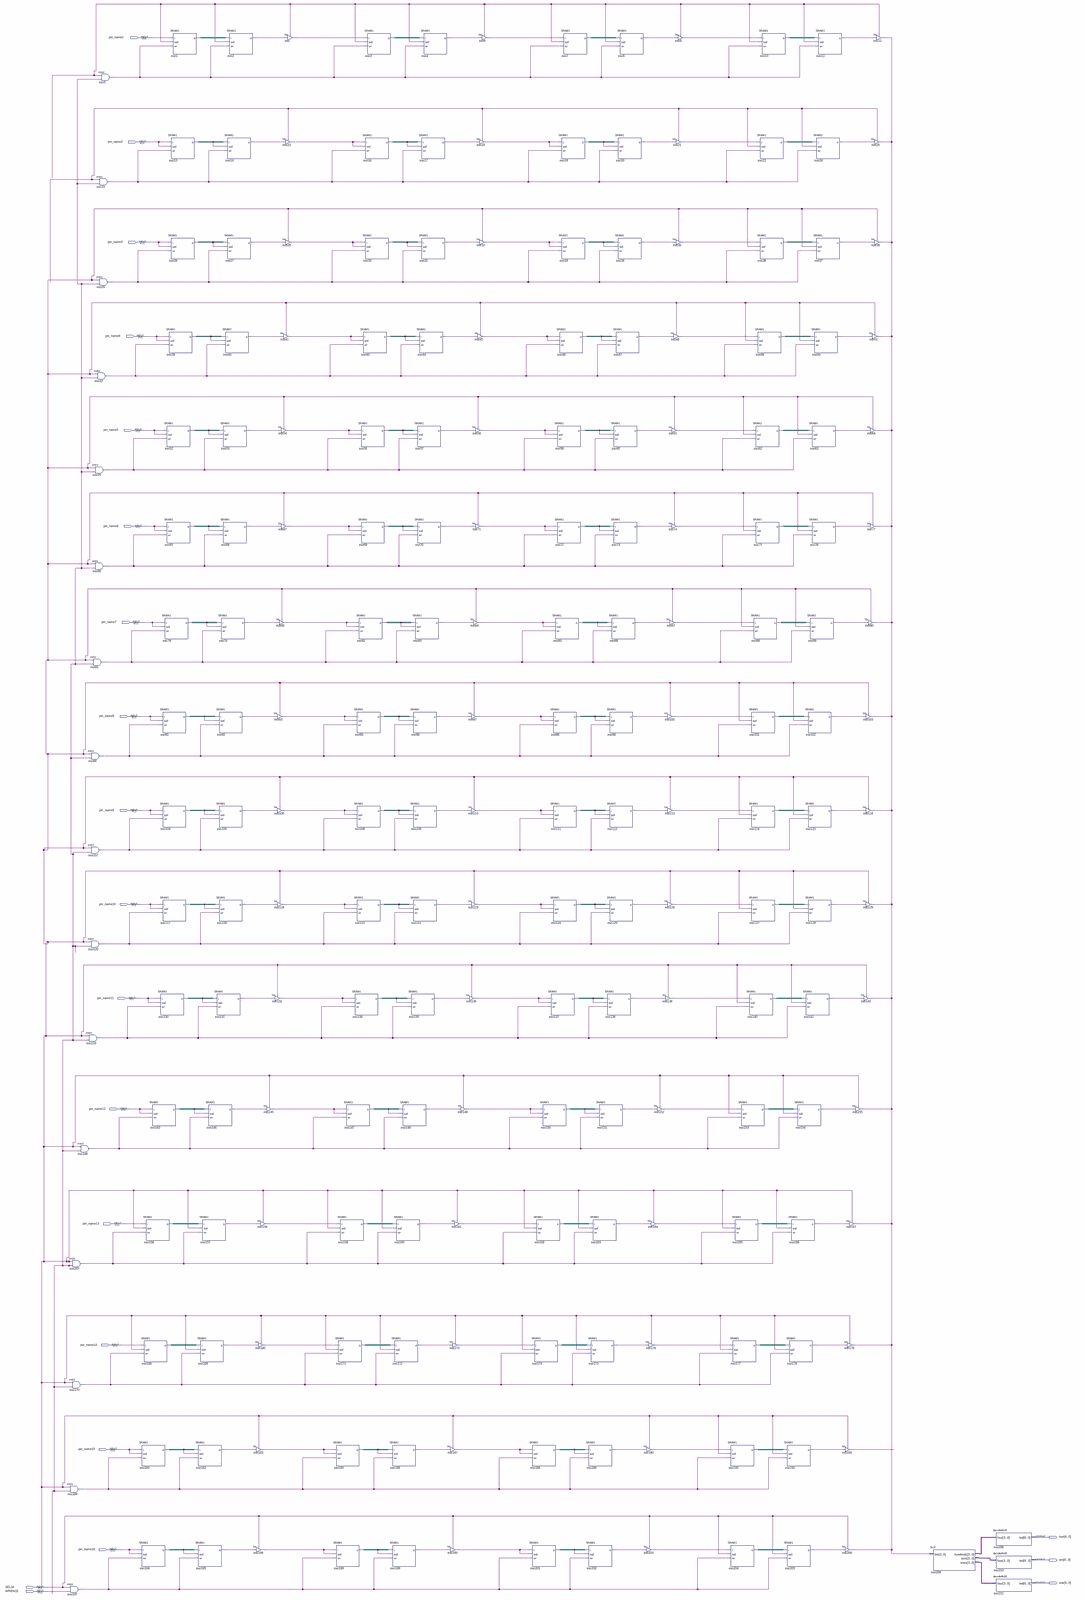
[diagram p0: schematic sheet, whole]
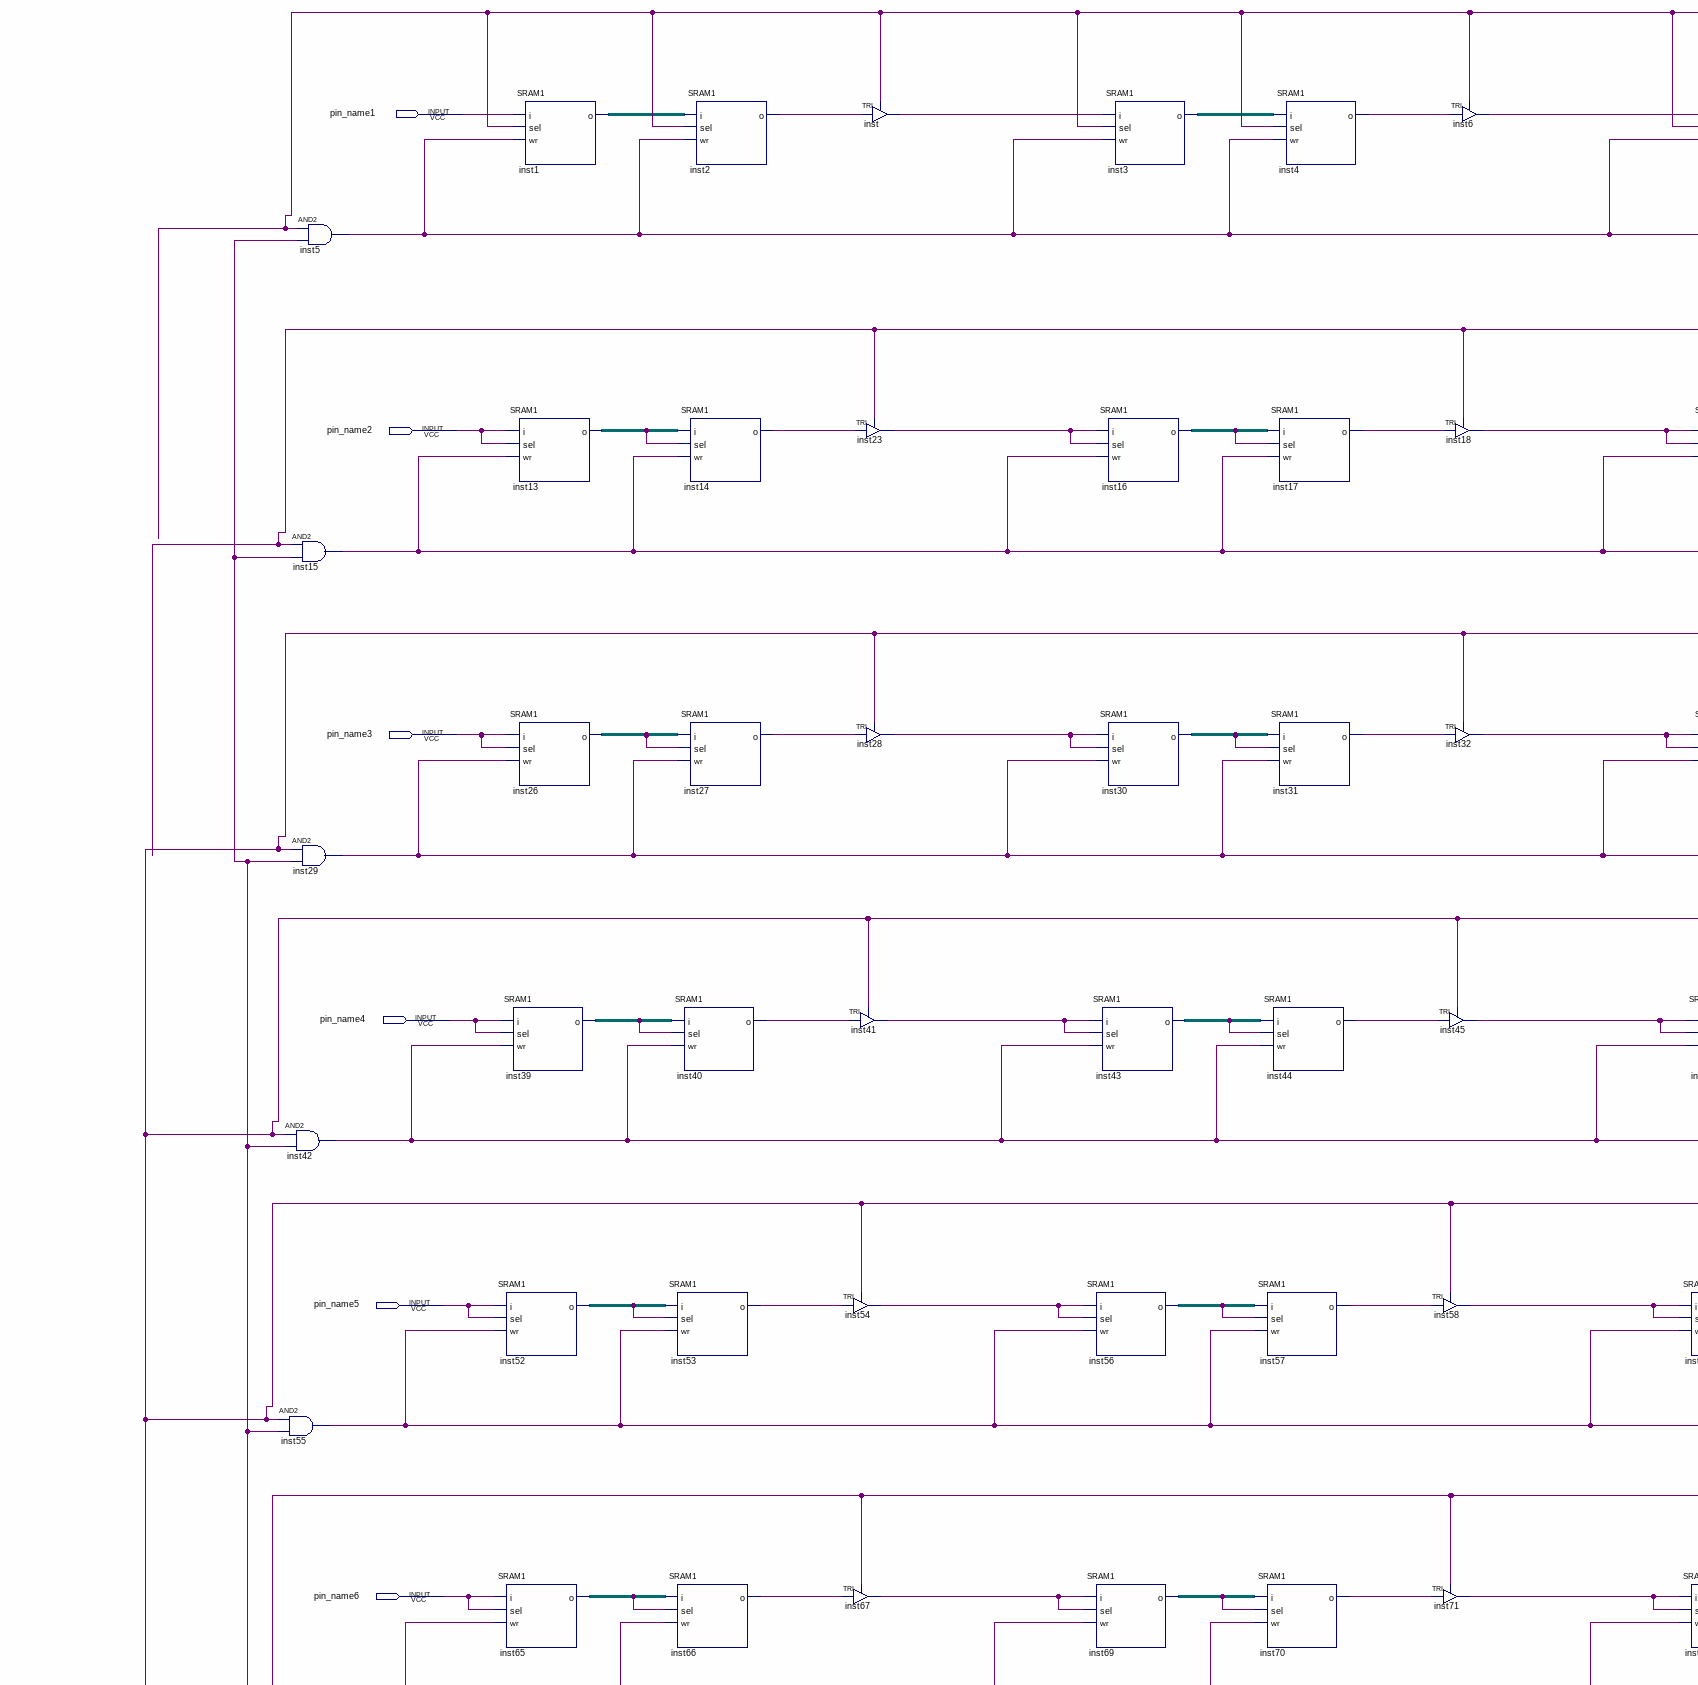
[diagram p1: schematic sheet, upper left part]
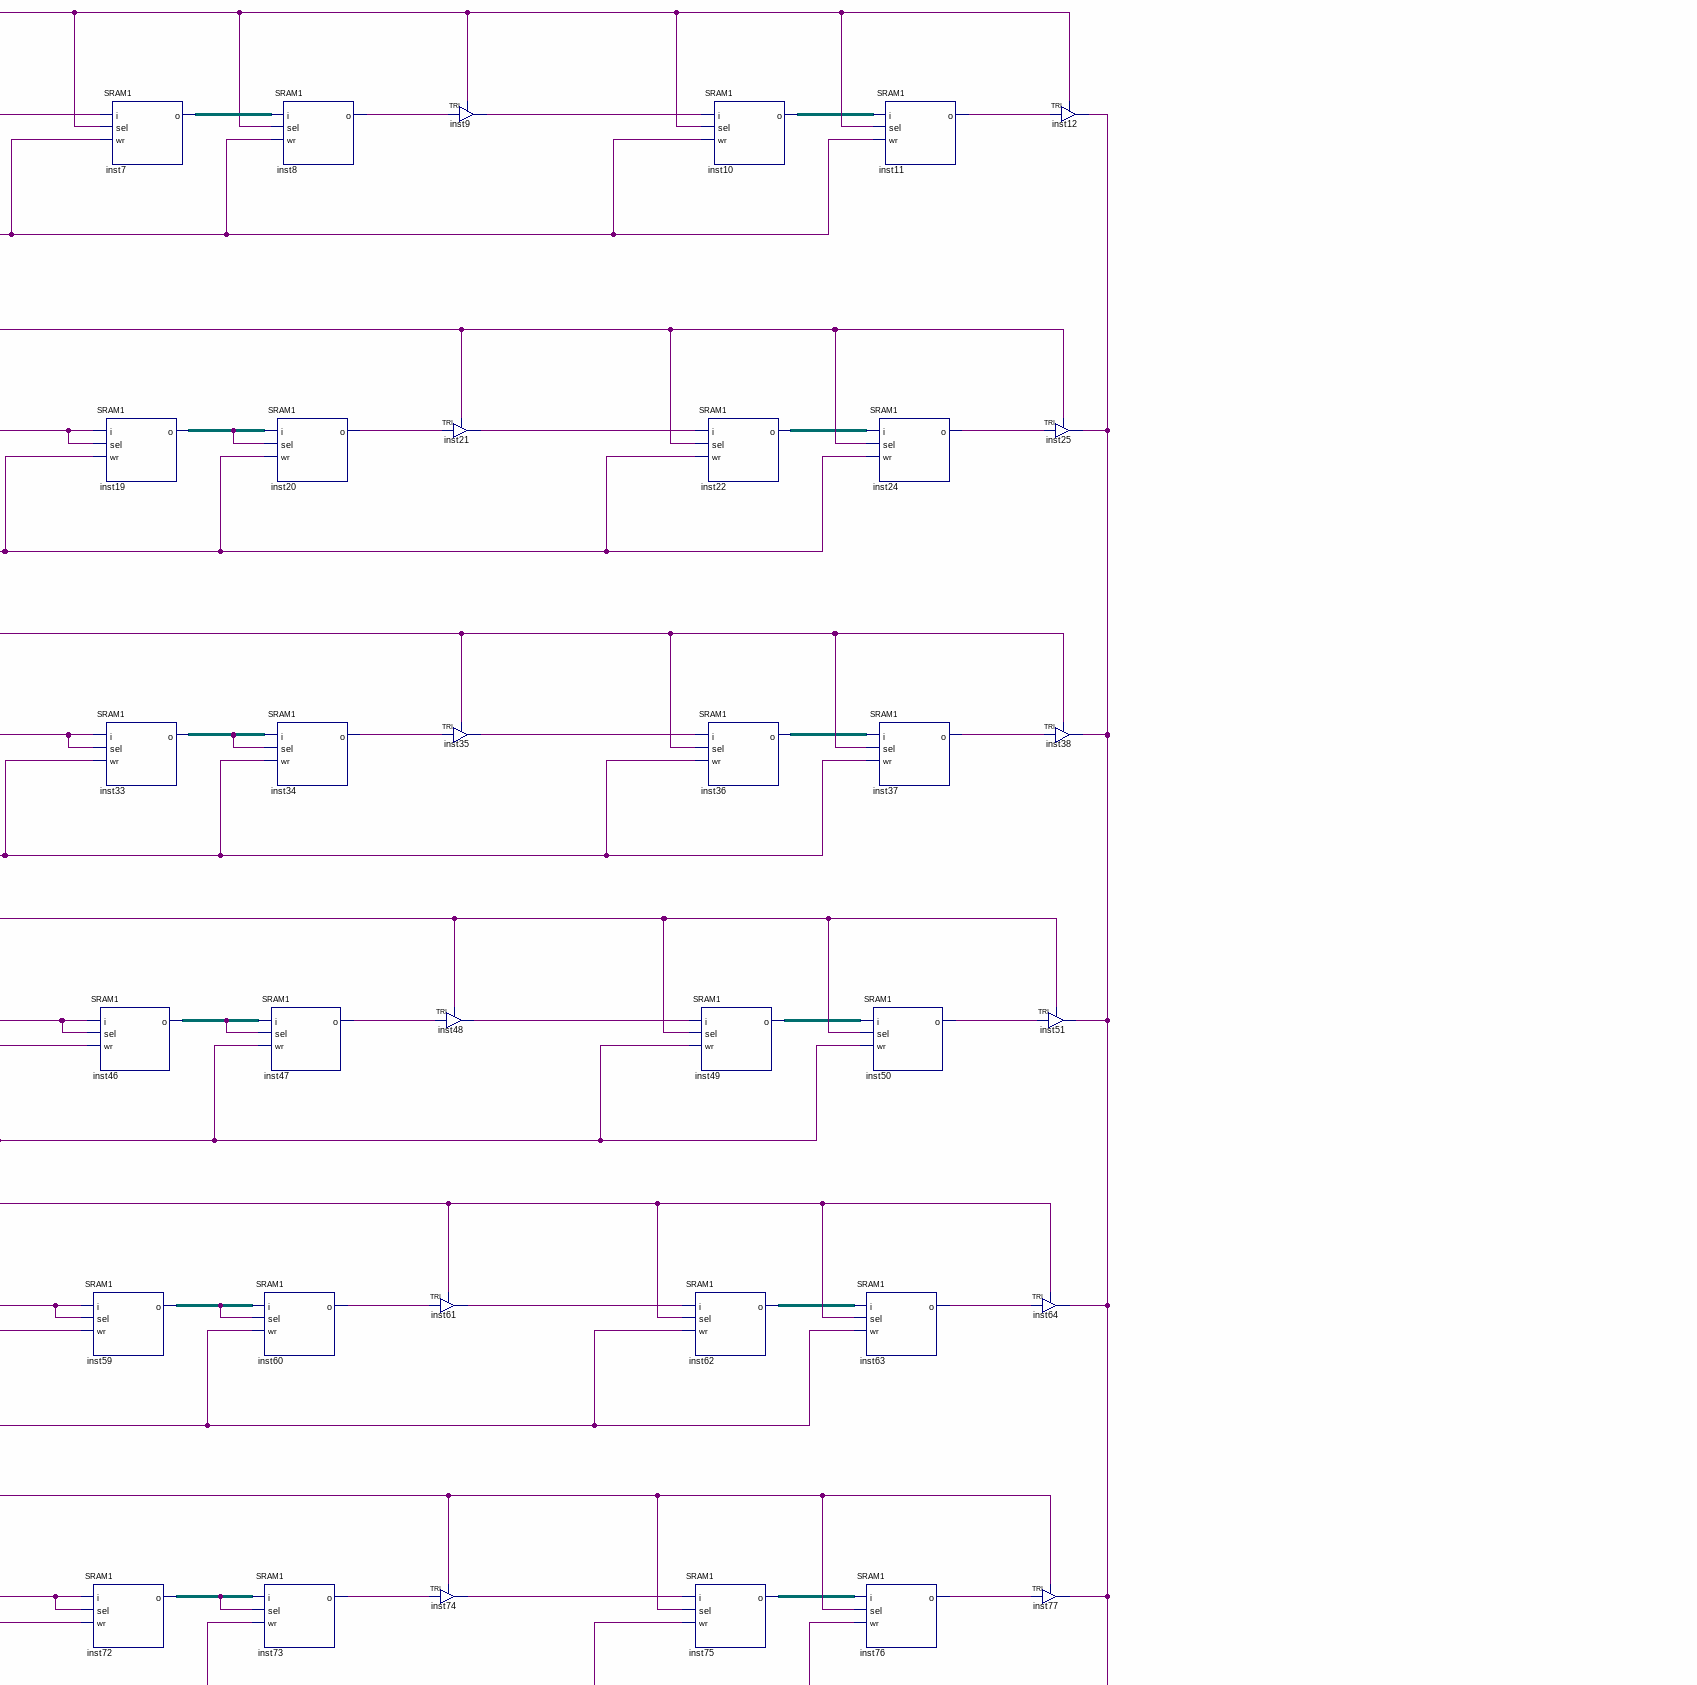
[diagram p2: schematic sheet, upper right part]
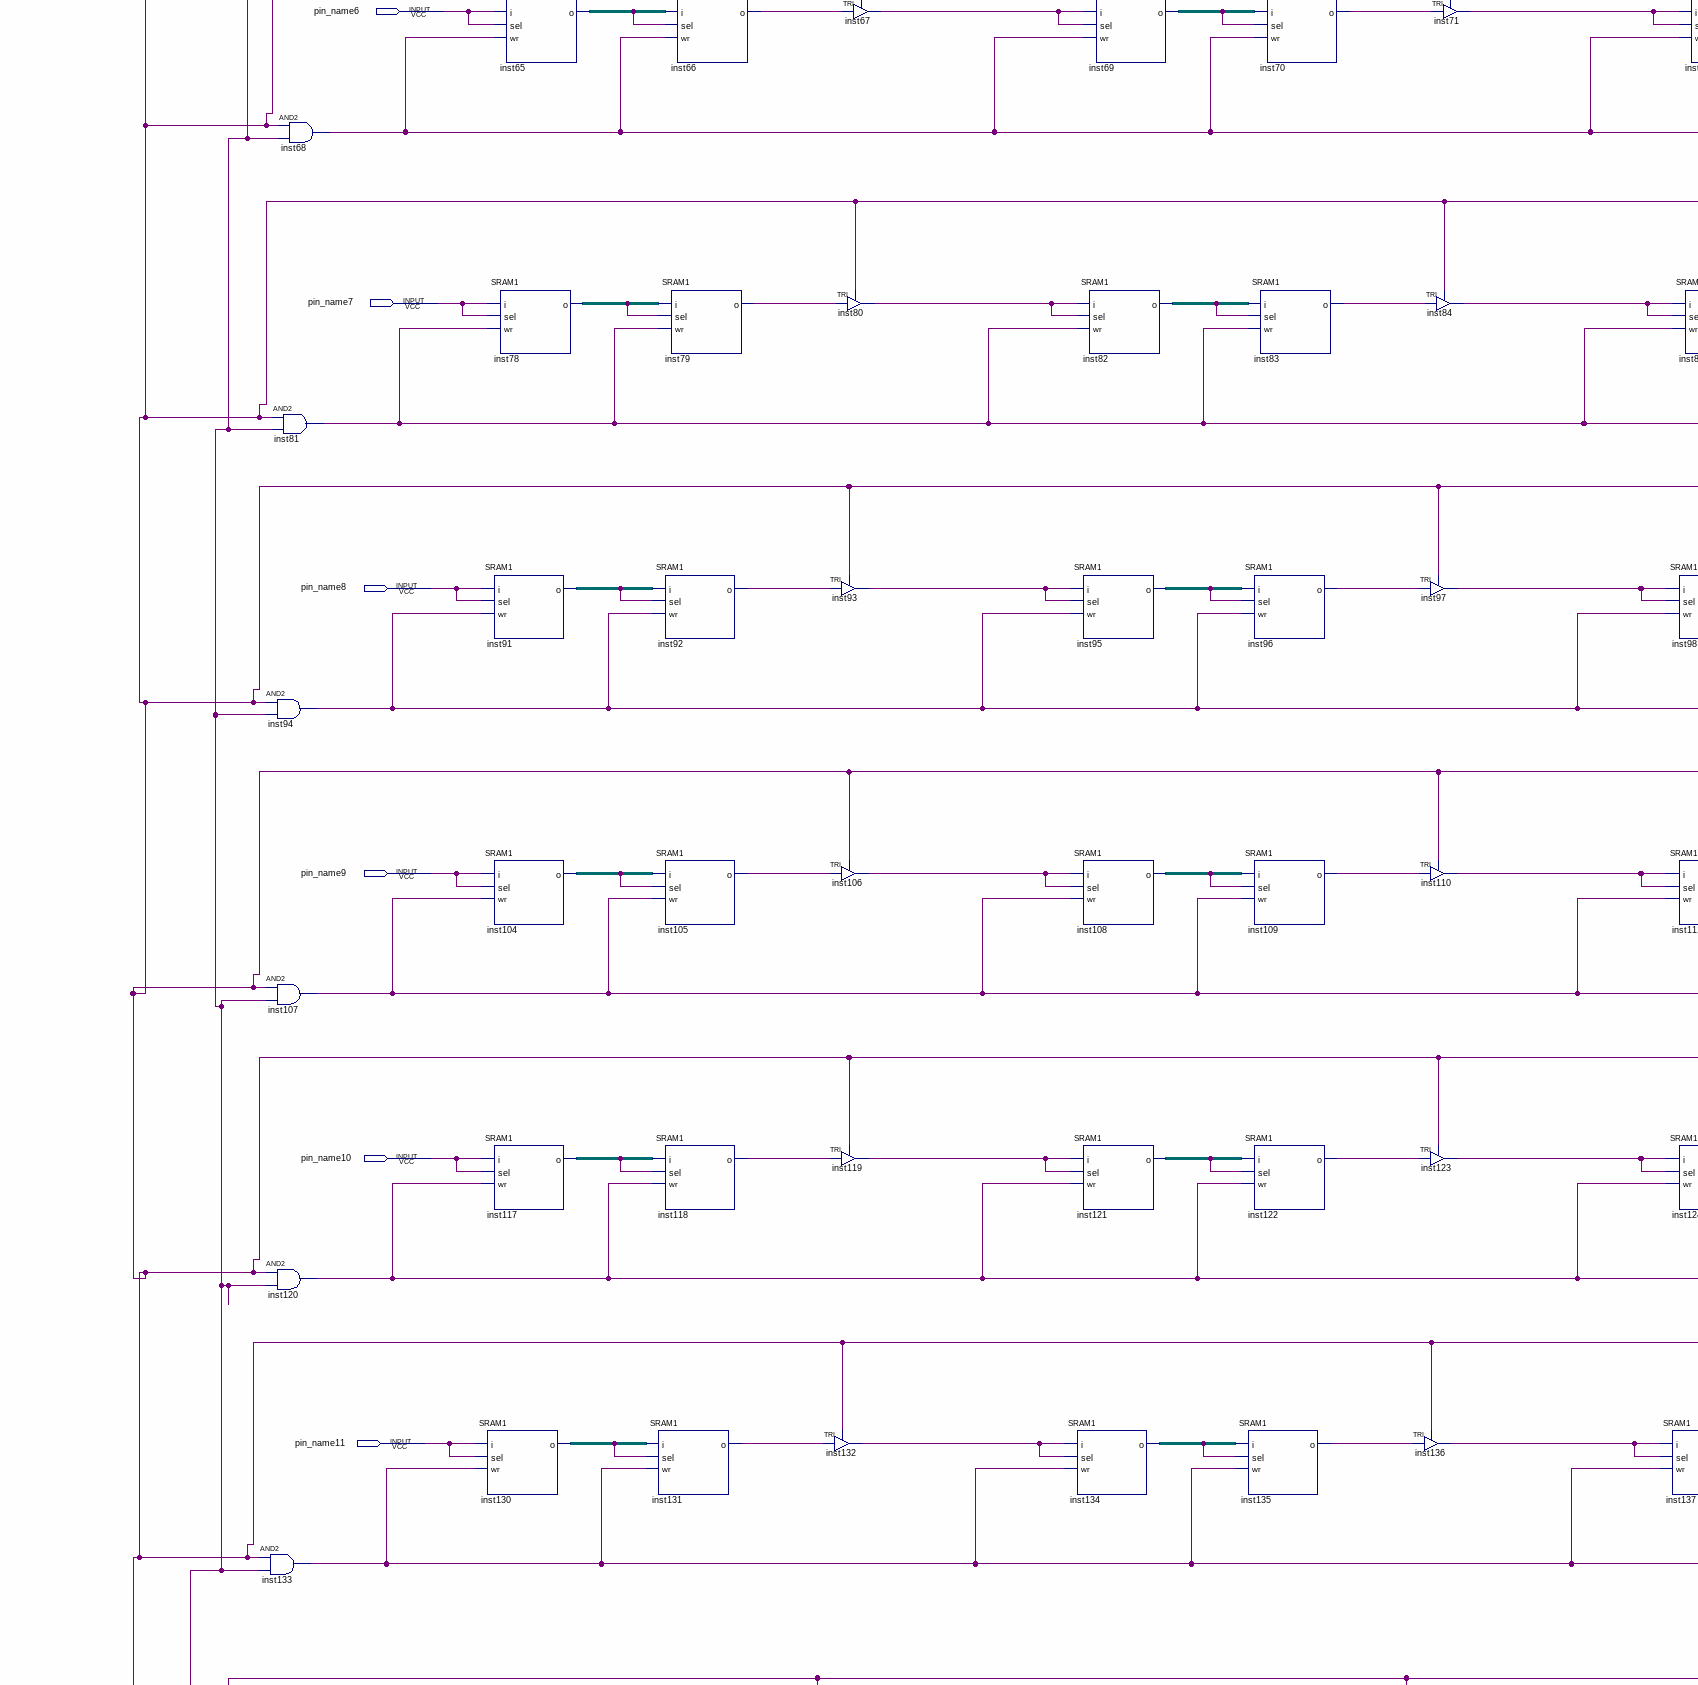
[diagram p3: schematic sheet, middle left part]
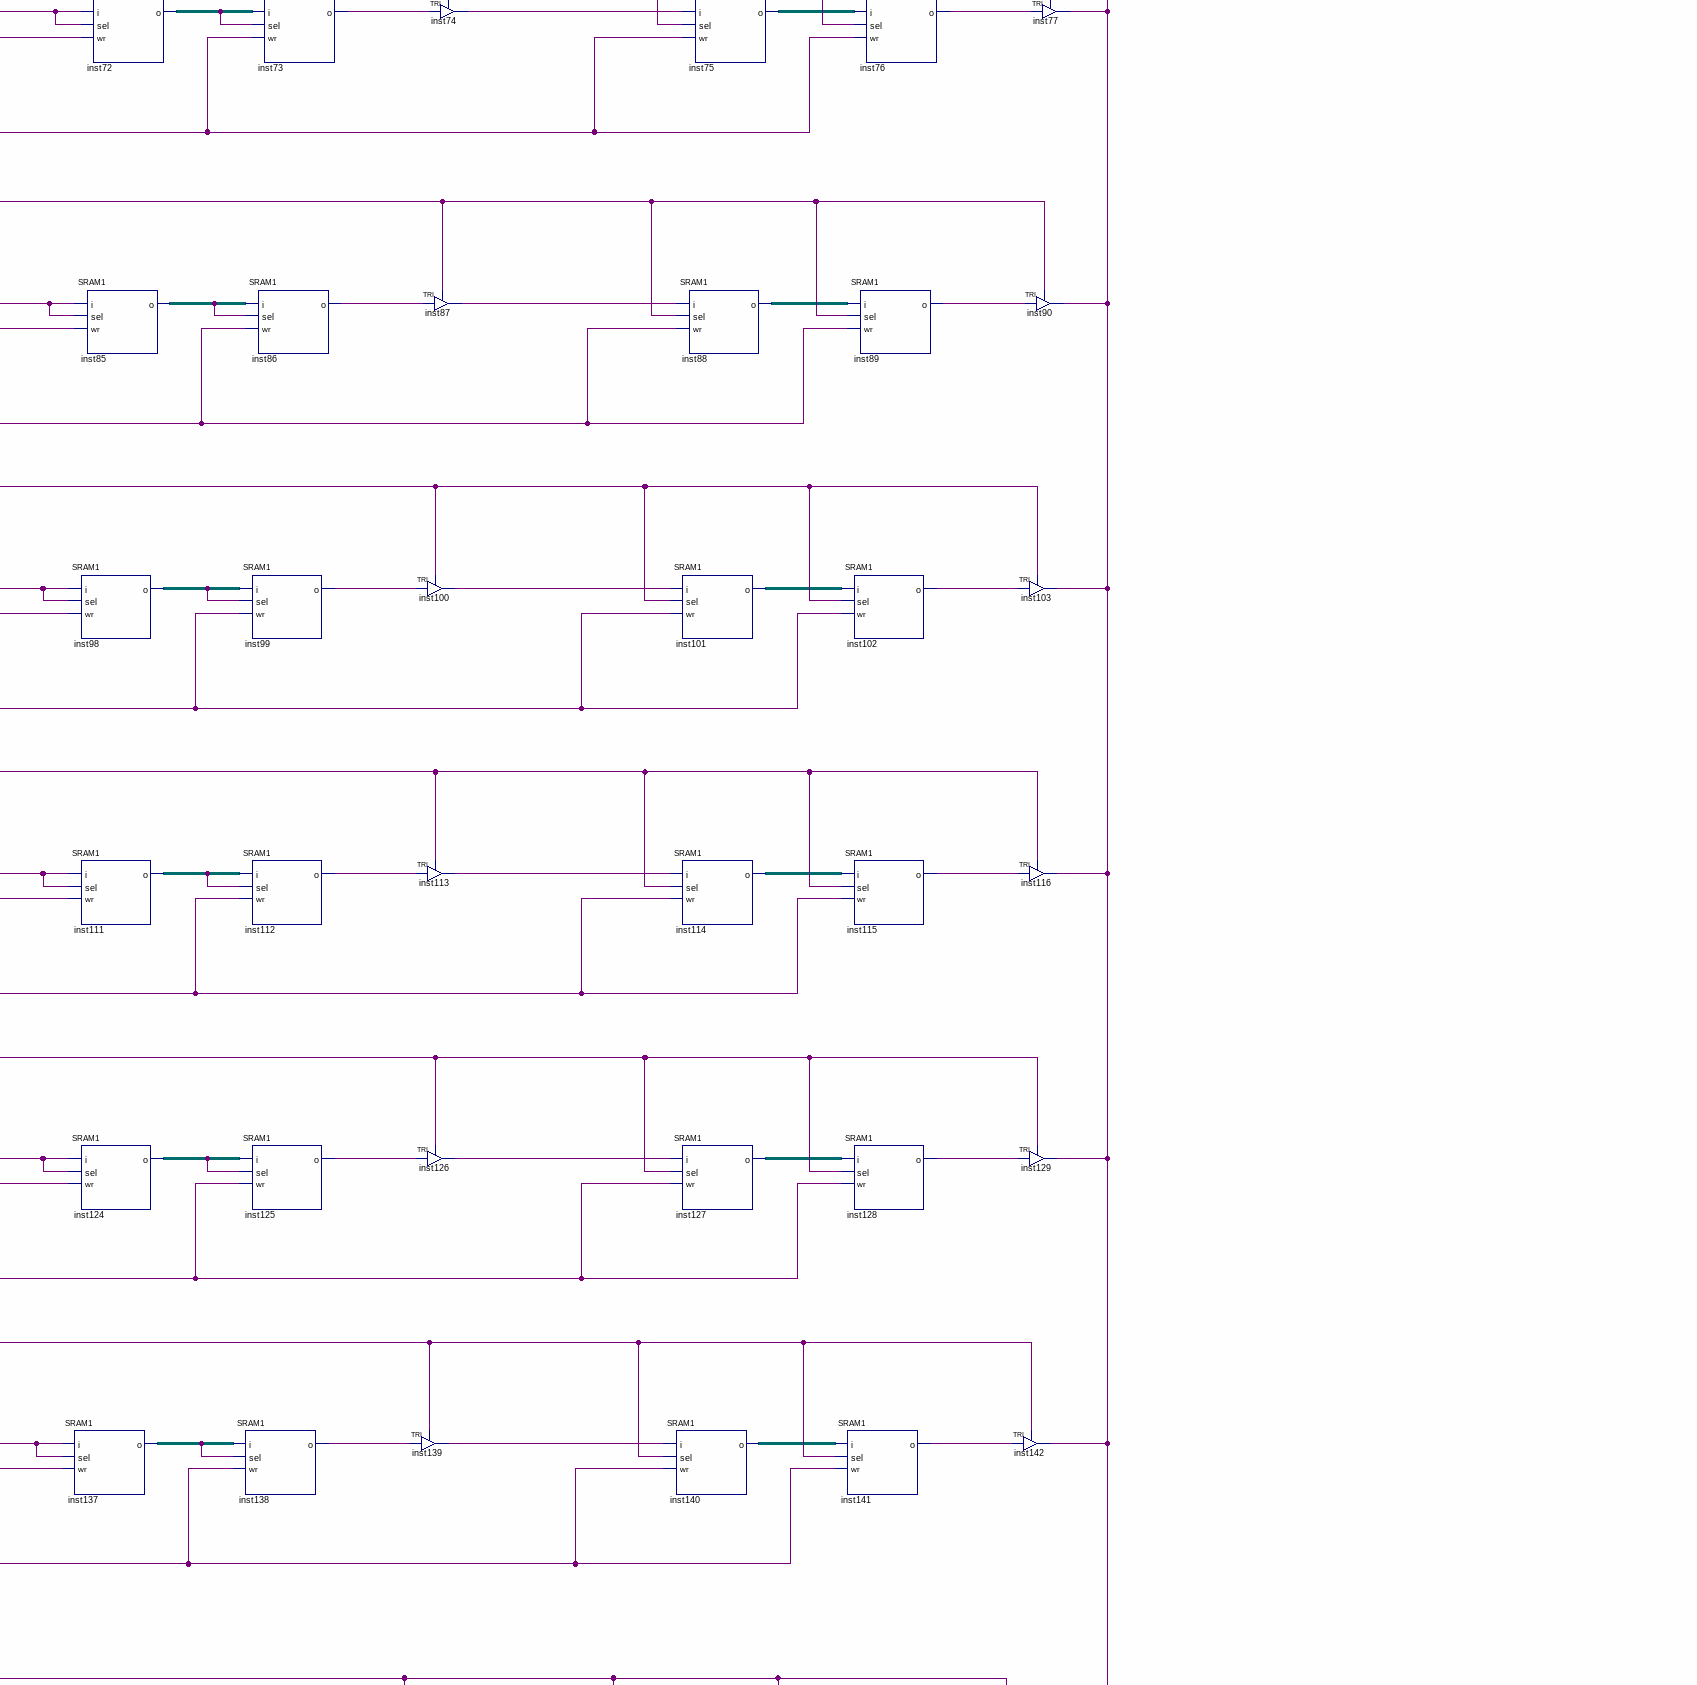
[diagram p4: schematic sheet, middle right part]
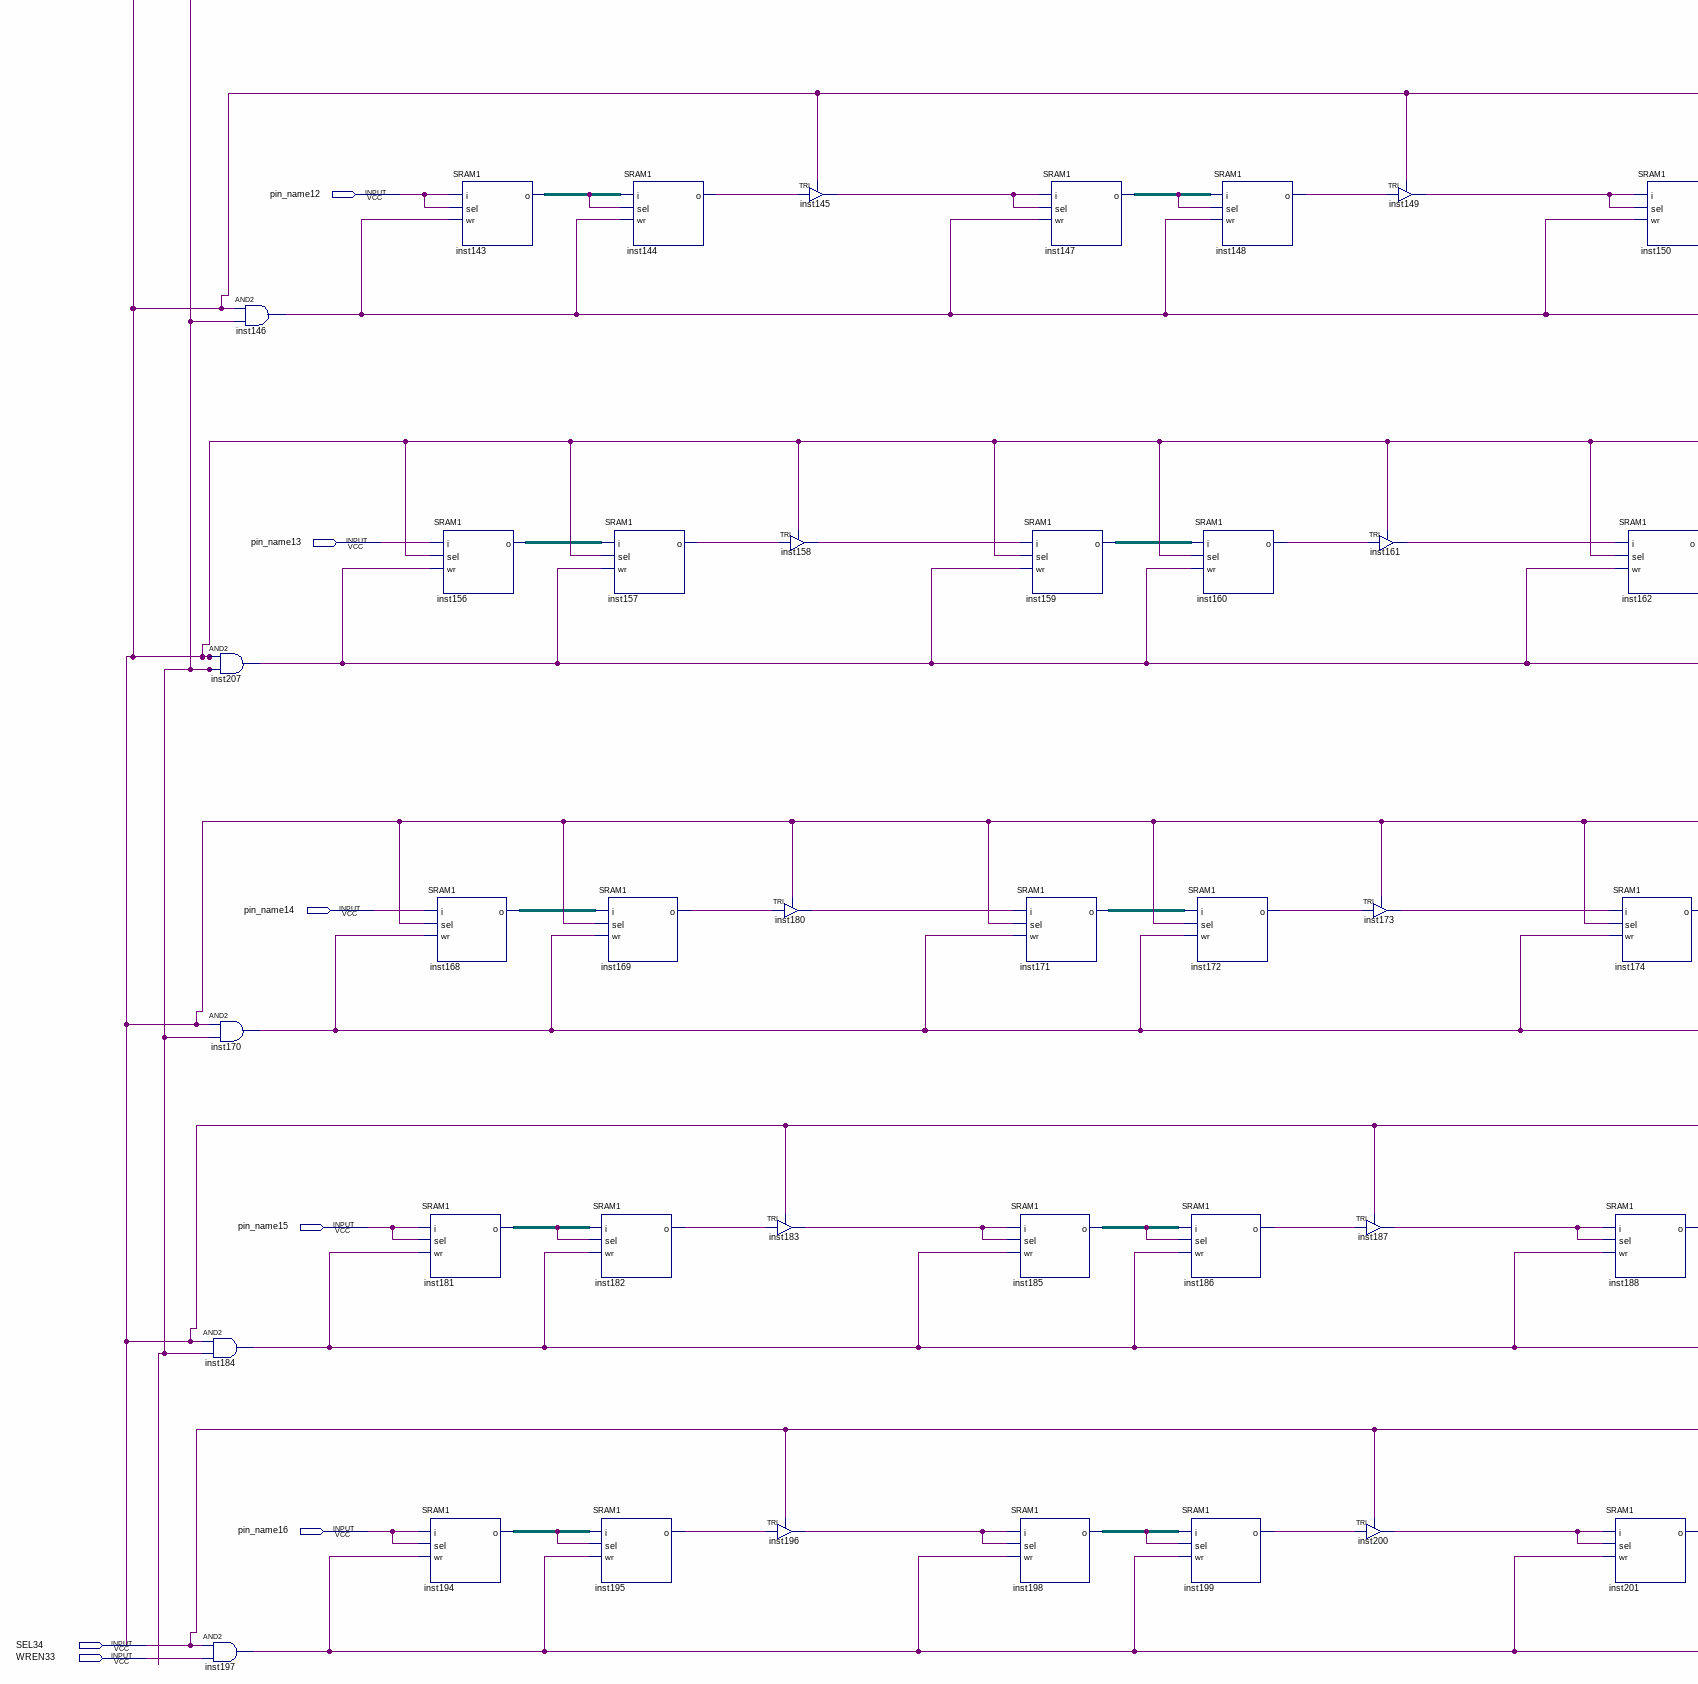
[diagram p5: schematic sheet, lower left part]
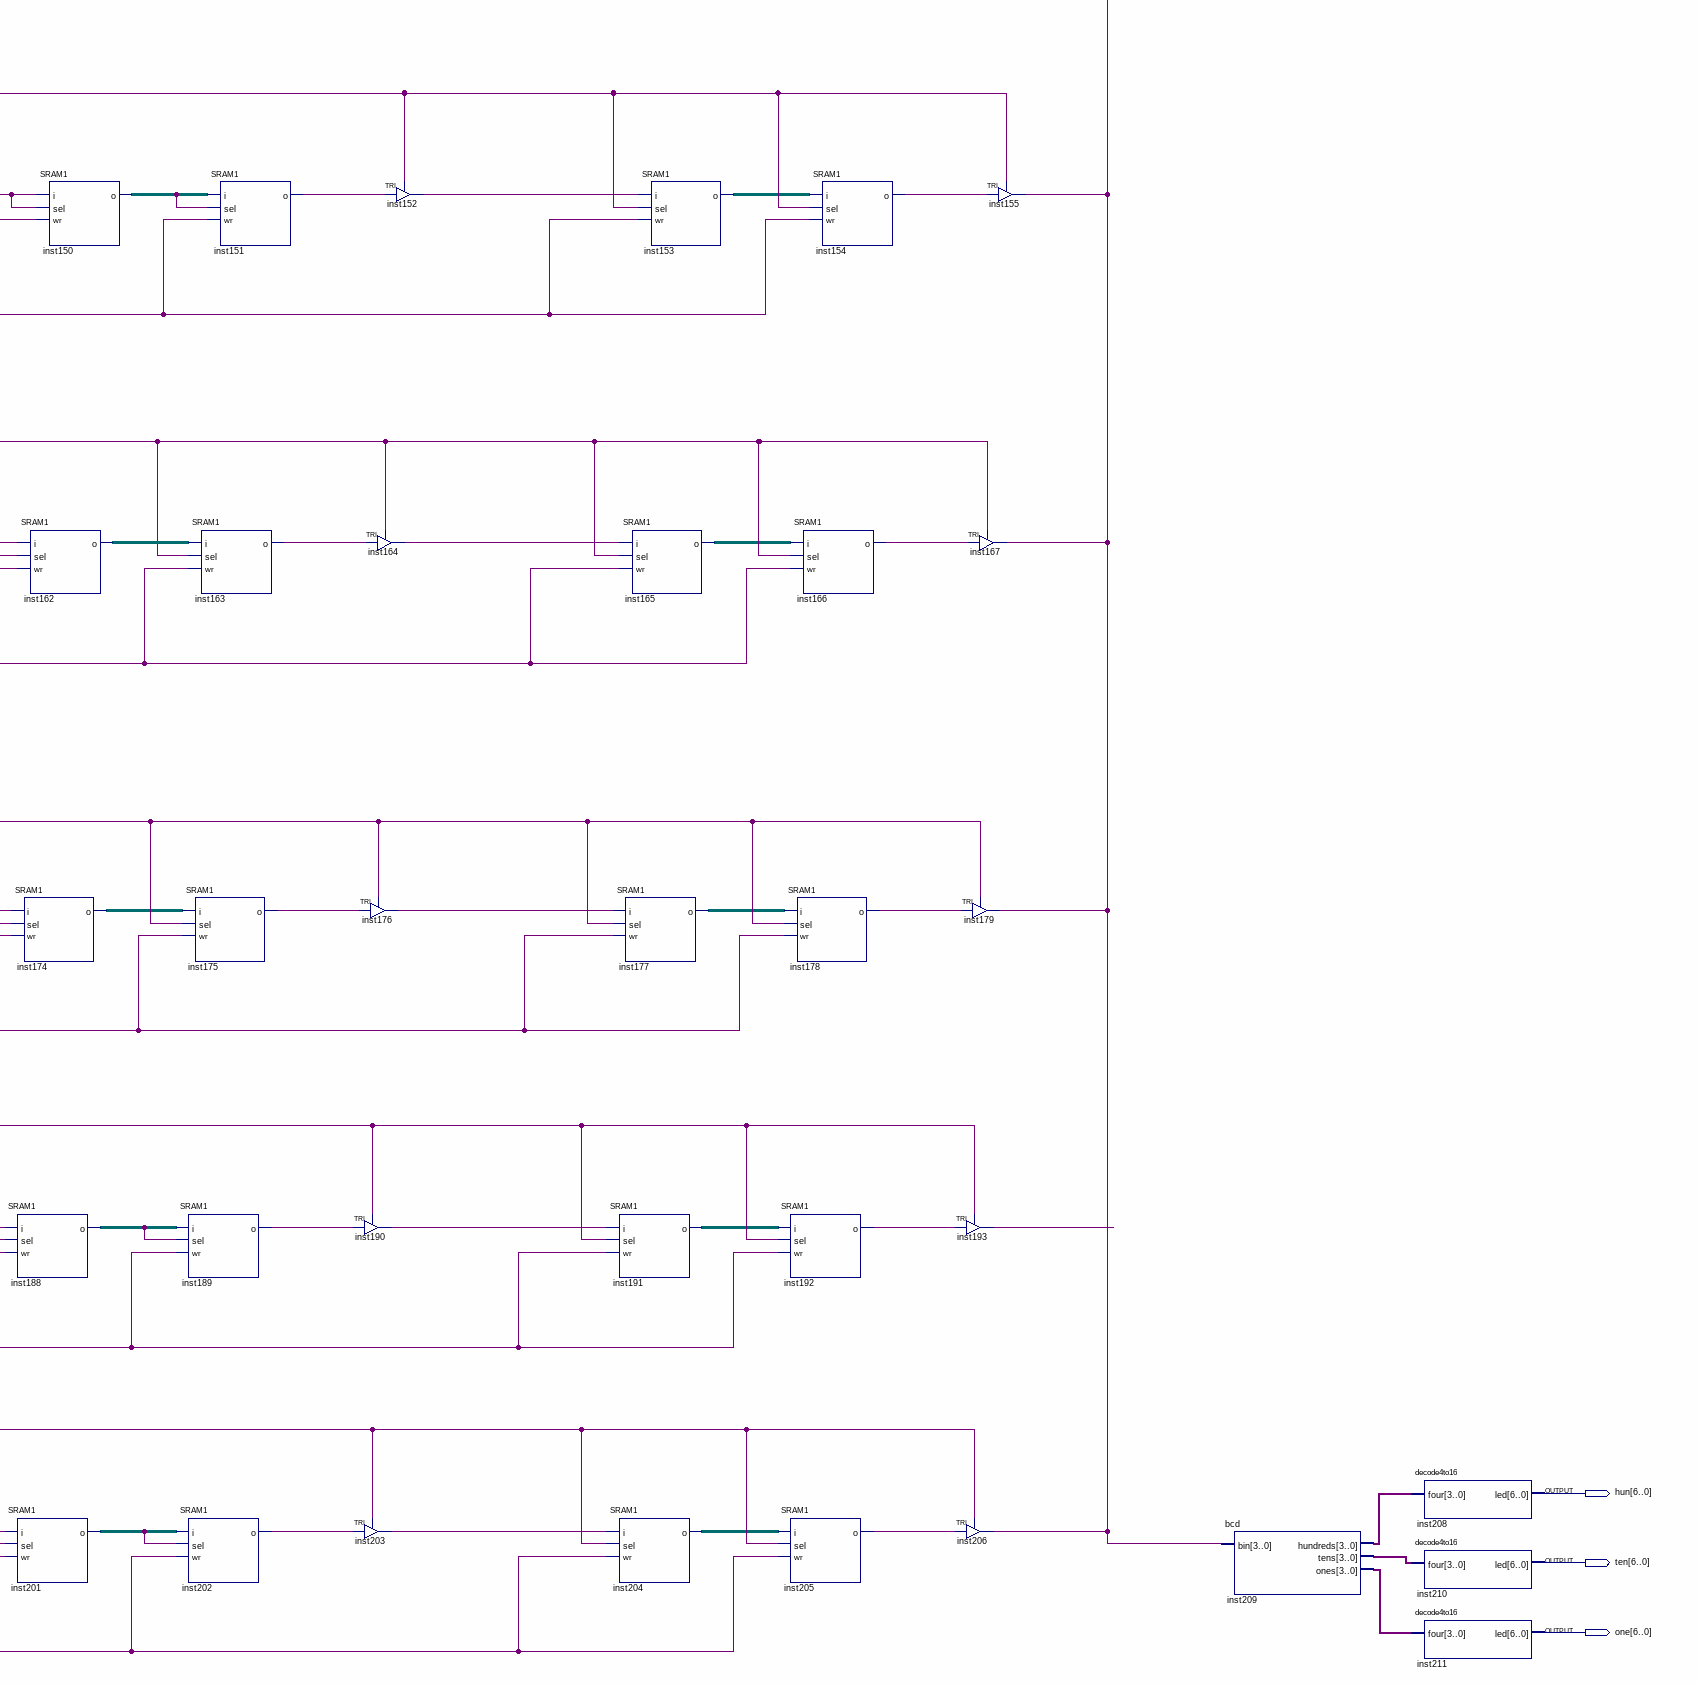
[diagram p6: schematic sheet, lower right part]
// Quartus schematic 16x4SRAM.bdf as structural Verilog: 212 symbols, 21 pins
module \16x4SRAM  (
  input  pin_name1,
  input  pin_name2,
  input  pin_name3,
  input  pin_name4,
  input  pin_name5,
  input  pin_name6,
  input  pin_name7,
  input  pin_name8,
  input  pin_name9,
  input  pin_name10,
  input  pin_name11,
  input  pin_name12,
  input  pin_name13,
  input  pin_name14,
  input  pin_name15,
  input  pin_name16,
  input  SEL34,
  input  WREN33,
  output [6:0] hun,
  output [6:0] ten,
  output [6:0] one
);

  wire inst2_o, inst4_o, inst5_out, inst6_out, inst8_o, inst9_out, inst11_o, inst14_o, inst15_out, inst17_o,
       inst18_out, inst20_o, inst21_out, inst23_out, inst24_o, inst27_o, inst28_out, inst29_out, inst31_o,
       inst32_out, inst34_o, inst35_out, inst37_o, inst40_o, inst41_out, inst42_out, inst44_o, inst45_out,
       inst47_o, inst48_out, inst50_o, inst53_o, inst54_out, inst55_out, inst57_o, inst58_out, inst60_o,
       inst61_out, inst63_o, inst66_o, inst67_out, inst68_out, inst70_o, inst71_out, inst73_o, inst74_out,
       inst76_o, inst79_o, inst80_out, inst81_out, inst83_o, inst84_out, inst86_o, inst87_out, inst89_o,
       inst92_o, inst93_out, inst94_out, inst96_o, inst97_out, inst99_o, inst100_out, inst102_o, inst105_o,
       inst106_out, inst107_out, inst109_o, inst110_out, inst112_o, inst113_out, inst115_o, inst118_o,
       inst119_out, inst120_out, inst122_o, inst123_out, inst125_o, inst126_out, inst128_o, inst131_o,
       inst132_out, inst133_out, inst135_o, inst136_out, inst138_o, inst139_out, inst141_o, inst144_o,
       inst145_out, inst146_out, inst148_o, inst149_out, inst151_o, inst152_out, inst154_o, inst157_o,
       inst158_out, inst160_o, inst161_out, inst163_o, inst164_out, inst166_o, inst169_o, inst170_out,
       inst172_o, inst173_out, inst175_o, inst176_out, inst178_o, inst180_out, inst182_o, inst183_out,
       inst184_out, inst186_o, inst187_out, inst189_o, inst190_out, inst192_o, inst193_out, inst195_o,
       inst196_out, inst197_out, inst199_o, inst200_out, inst202_o, inst203_out, inst205_o, inst206_out,
       inst207_out, inst_out, undriven, undriven_2, undriven_3, undriven_4, undriven_5, undriven_6,
       undriven_7, undriven_8, undriven_9, undriven_10, undriven_11, undriven_12, undriven_13, undriven_14,
       undriven_15, undriven_16, undriven_17, undriven_18, undriven_19, undriven_20, undriven_21,
       undriven_22, undriven_23, undriven_24, undriven_25, undriven_26, undriven_27, undriven_28,
       undriven_29, undriven_30, undriven_31, undriven_32, undriven_33, undriven_34, undriven_35,
       undriven_36, undriven_37, undriven_38, undriven_39, undriven_40, undriven_41, undriven_42, undriven_43;
  wire [3:0] inst209_hundreds, inst209_ones, inst209_tens;

  and inst207 (inst207_out, undriven_5, undriven_43);
  and inst170 (inst170_out, undriven_5, undriven_43);
  and inst184 (inst184_out, undriven_5, undriven_43);
  and inst197 (inst197_out, SEL34, WREN33);
  and inst81 (inst81_out, undriven_5, undriven_43);
  and inst94 (inst94_out, undriven_5, undriven_43);
  and inst107 (inst107_out, undriven_5, undriven_43);
  and inst120 (inst120_out, undriven_5, undriven_43);
  and inst133 (inst133_out, undriven_5, undriven_43);
  and inst146 (inst146_out, undriven_5, undriven_43);
  and inst5 (inst5_out, undriven_42, undriven_43);
  and inst15 (inst15_out, undriven_41, undriven_43);
  and inst29 (inst29_out, undriven_5, undriven_43);
  and inst42 (inst42_out, undriven_5, undriven_43);
  and inst55 (inst55_out, undriven_5, undriven_43);
  and inst68 (inst68_out, undriven_5, undriven_43);
  SRAM1 inst168 (.i(pin_name14), .sel(undriven_5), .wr(inst170_out));  // open: o
  SRAM1 inst181 (.i(pin_name15), .sel(pin_name15), .wr(inst184_out));  // open: o
  SRAM1 inst194 (.i(pin_name16), .sel(pin_name16), .wr(inst197_out));  // open: o
  SRAM1 inst130 (.i(pin_name11), .sel(pin_name11), .wr(inst133_out));  // open: o
  SRAM1 inst143 (.i(pin_name12), .sel(pin_name12), .wr(inst146_out));  // open: o
  SRAM1 inst156 (.i(pin_name13), .sel(undriven_5), .wr(inst207_out));  // open: o
  SRAM1 inst1 (.i(pin_name1), .sel(undriven_42), .wr(inst5_out));  // open: o
  SRAM1 inst13 (.i(pin_name2), .sel(pin_name2), .wr(inst15_out));  // open: o
  SRAM1 inst26 (.i(pin_name3), .sel(pin_name3), .wr(inst29_out));  // open: o
  SRAM1 inst39 (.i(pin_name4), .sel(pin_name4), .wr(inst42_out));  // open: o
  SRAM1 inst52 (.i(pin_name5), .sel(pin_name5), .wr(inst55_out));  // open: o
  SRAM1 inst65 (.i(pin_name6), .sel(pin_name6), .wr(inst68_out));  // open: o
  SRAM1 inst78 (.i(pin_name7), .sel(pin_name7), .wr(inst81_out));  // open: o
  SRAM1 inst91 (.i(pin_name8), .sel(pin_name8), .wr(inst94_out));  // open: o
  SRAM1 inst104 (.i(pin_name9), .sel(pin_name9), .wr(inst107_out));  // open: o
  SRAM1 inst117 (.i(pin_name10), .sel(pin_name10), .wr(inst120_out));  // open: o
  SRAM1 inst144 (.sel(undriven_32), .wr(inst146_out), .o(inst144_o));  // open: i
  SRAM1 inst157 (.sel(undriven_5), .wr(inst207_out), .o(inst157_o));  // open: i
  SRAM1 inst169 (.sel(undriven_5), .wr(inst170_out), .o(inst169_o));  // open: i
  SRAM1 inst182 (.sel(undriven_35), .wr(inst184_out), .o(inst182_o));  // open: i
  SRAM1 inst195 (.sel(undriven_38), .wr(inst197_out), .o(inst195_o));  // open: i
  SRAM1 inst14 (.sel(undriven), .wr(inst15_out), .o(inst14_o));  // open: i
  SRAM1 inst27 (.sel(undriven_4), .wr(inst29_out), .o(inst27_o));  // open: i
  SRAM1 inst40 (.sel(undriven_8), .wr(inst42_out), .o(inst40_o));  // open: i
  SRAM1 inst53 (.sel(undriven_11), .wr(inst55_out), .o(inst53_o));  // open: i
  SRAM1 inst66 (.sel(undriven_14), .wr(inst68_out), .o(inst66_o));  // open: i
  SRAM1 inst79 (.sel(undriven_17), .wr(inst81_out), .o(inst79_o));  // open: i
  SRAM1 inst92 (.sel(undriven_20), .wr(inst94_out), .o(inst92_o));  // open: i
  SRAM1 inst105 (.sel(undriven_23), .wr(inst107_out), .o(inst105_o));  // open: i
  SRAM1 inst118 (.sel(undriven_26), .wr(inst120_out), .o(inst118_o));  // open: i
  SRAM1 inst131 (.sel(undriven_29), .wr(inst133_out), .o(inst131_o));  // open: i
  SRAM1 inst2 (.sel(undriven_42), .wr(inst5_out), .o(inst2_o));  // open: i
  TRI inst158 (.IN(inst157_o), .OE(undriven_5), .OUT(inst158_out));
  TRI inst180 (.IN(inst169_o), .OE(undriven_5), .OUT(inst180_out));
  TRI inst183 (.IN(inst182_o), .OE(undriven_5), .OUT(inst183_out));
  TRI inst196 (.IN(inst195_o), .OE(SEL34), .OUT(inst196_out));
  TRI inst93 (.IN(inst92_o), .OE(undriven_5), .OUT(inst93_out));
  TRI inst106 (.IN(inst105_o), .OE(undriven_5), .OUT(inst106_out));
  TRI inst119 (.IN(inst118_o), .OE(undriven_5), .OUT(inst119_out));
  TRI inst132 (.IN(inst131_o), .OE(undriven_5), .OUT(inst132_out));
  TRI inst145 (.IN(inst144_o), .OE(undriven_5), .OUT(inst145_out));
  TRI inst (.IN(inst2_o), .OE(undriven_42), .OUT(inst_out));
  TRI inst23 (.IN(inst14_o), .OE(undriven_41), .OUT(inst23_out));
  TRI inst28 (.IN(inst27_o), .OE(undriven_5), .OUT(inst28_out));
  TRI inst41 (.IN(inst40_o), .OE(undriven_5), .OUT(inst41_out));
  TRI inst54 (.IN(inst53_o), .OE(undriven_5), .OUT(inst54_out));
  TRI inst67 (.IN(inst66_o), .OE(undriven_5), .OUT(inst67_out));
  TRI inst80 (.IN(inst79_o), .OE(undriven_5), .OUT(inst80_out));
  SRAM1 inst159 (.i(inst158_out), .sel(undriven_5), .wr(inst207_out));  // open: o
  SRAM1 inst171 (.i(inst180_out), .sel(undriven_5), .wr(inst170_out));  // open: o
  SRAM1 inst185 (.i(inst183_out), .sel(inst183_out), .wr(inst184_out));  // open: o
  SRAM1 inst198 (.i(inst196_out), .sel(inst196_out), .wr(inst197_out));  // open: o
  SRAM1 inst56 (.i(inst54_out), .sel(inst54_out), .wr(inst55_out));  // open: o
  SRAM1 inst69 (.i(inst67_out), .sel(inst67_out), .wr(inst68_out));  // open: o
  SRAM1 inst82 (.i(inst80_out), .sel(inst80_out), .wr(inst81_out));  // open: o
  SRAM1 inst95 (.i(inst93_out), .sel(inst93_out), .wr(inst94_out));  // open: o
  SRAM1 inst108 (.i(inst106_out), .sel(inst106_out), .wr(inst107_out));  // open: o
  SRAM1 inst121 (.i(inst119_out), .sel(inst119_out), .wr(inst120_out));  // open: o
  SRAM1 inst134 (.i(inst132_out), .sel(inst132_out), .wr(inst133_out));  // open: o
  SRAM1 inst147 (.i(inst145_out), .sel(inst145_out), .wr(inst146_out));  // open: o
  SRAM1 inst3 (.i(inst_out), .sel(undriven_42), .wr(inst5_out));  // open: o
  SRAM1 inst16 (.i(inst23_out), .sel(inst23_out), .wr(inst15_out));  // open: o
  SRAM1 inst30 (.i(inst28_out), .sel(inst28_out), .wr(inst29_out));  // open: o
  SRAM1 inst43 (.i(inst41_out), .sel(inst41_out), .wr(inst42_out));  // open: o
  SRAM1 inst172 (.sel(undriven_5), .wr(inst170_out), .o(inst172_o));  // open: i
  SRAM1 inst186 (.sel(undriven_36), .wr(inst184_out), .o(inst186_o));  // open: i
  SRAM1 inst199 (.sel(undriven_39), .wr(inst197_out), .o(inst199_o));  // open: i
  SRAM1 inst135 (.sel(undriven_30), .wr(inst133_out), .o(inst135_o));  // open: i
  SRAM1 inst148 (.sel(undriven_33), .wr(inst146_out), .o(inst148_o));  // open: i
  SRAM1 inst160 (.sel(undriven_5), .wr(inst207_out), .o(inst160_o));  // open: i
  SRAM1 inst4 (.sel(undriven_42), .wr(inst5_out), .o(inst4_o));  // open: i
  SRAM1 inst17 (.sel(undriven_2), .wr(inst15_out), .o(inst17_o));  // open: i
  SRAM1 inst31 (.sel(undriven_6), .wr(inst29_out), .o(inst31_o));  // open: i
  SRAM1 inst44 (.sel(undriven_9), .wr(inst42_out), .o(inst44_o));  // open: i
  SRAM1 inst57 (.sel(undriven_12), .wr(inst55_out), .o(inst57_o));  // open: i
  SRAM1 inst70 (.sel(undriven_15), .wr(inst68_out), .o(inst70_o));  // open: i
  SRAM1 inst83 (.sel(undriven_18), .wr(inst81_out), .o(inst83_o));  // open: i
  SRAM1 inst96 (.sel(undriven_21), .wr(inst94_out), .o(inst96_o));  // open: i
  SRAM1 inst109 (.sel(undriven_24), .wr(inst107_out), .o(inst109_o));  // open: i
  SRAM1 inst122 (.sel(undriven_27), .wr(inst120_out), .o(inst122_o));  // open: i
  TRI inst149 (.IN(inst148_o), .OE(undriven_5), .OUT(inst149_out));
  TRI inst161 (.IN(inst160_o), .OE(undriven_5), .OUT(inst161_out));
  TRI inst173 (.IN(inst172_o), .OE(undriven_5), .OUT(inst173_out));
  TRI inst187 (.IN(inst186_o), .OE(undriven_5), .OUT(inst187_out));
  TRI inst200 (.IN(inst199_o), .OE(SEL34), .OUT(inst200_out));
  TRI inst45 (.IN(inst44_o), .OE(undriven_5), .OUT(inst45_out));
  TRI inst58 (.IN(inst57_o), .OE(undriven_5), .OUT(inst58_out));
  TRI inst71 (.IN(inst70_o), .OE(undriven_5), .OUT(inst71_out));
  TRI inst84 (.IN(inst83_o), .OE(undriven_5), .OUT(inst84_out));
  TRI inst97 (.IN(inst96_o), .OE(undriven_5), .OUT(inst97_out));
  TRI inst110 (.IN(inst109_o), .OE(undriven_5), .OUT(inst110_out));
  TRI inst123 (.IN(inst122_o), .OE(undriven_5), .OUT(inst123_out));
  TRI inst136 (.IN(inst135_o), .OE(undriven_5), .OUT(inst136_out));
  TRI inst6 (.IN(inst4_o), .OE(undriven_42), .OUT(inst6_out));
  TRI inst18 (.IN(inst17_o), .OE(undriven_41), .OUT(inst18_out));
  TRI inst32 (.IN(inst31_o), .OE(undriven_5), .OUT(inst32_out));
  SRAM1 inst150 (.i(inst149_out), .sel(inst149_out), .wr(inst146_out));  // open: o
  SRAM1 inst162 (.i(inst161_out), .sel(undriven_5), .wr(inst207_out));  // open: o
  SRAM1 inst174 (.i(inst173_out), .sel(undriven_5), .wr(inst170_out));  // open: o
  SRAM1 inst188 (.i(inst187_out), .sel(inst187_out), .wr(inst184_out));  // open: o
  SRAM1 inst201 (.i(inst200_out), .sel(inst200_out), .wr(inst197_out));  // open: o
  SRAM1 inst19 (.i(inst18_out), .sel(inst18_out), .wr(inst15_out));  // open: o
  SRAM1 inst33 (.i(inst32_out), .sel(inst32_out), .wr(inst29_out));  // open: o
  SRAM1 inst46 (.i(inst45_out), .sel(inst45_out), .wr(inst42_out));  // open: o
  SRAM1 inst59 (.i(inst58_out), .sel(inst58_out), .wr(inst55_out));  // open: o
  SRAM1 inst72 (.i(inst71_out), .sel(inst71_out), .wr(inst68_out));  // open: o
  SRAM1 inst85 (.i(inst84_out), .sel(inst84_out), .wr(inst81_out));  // open: o
  SRAM1 inst98 (.i(inst97_out), .sel(inst97_out), .wr(inst94_out));  // open: o
  SRAM1 inst111 (.i(inst110_out), .sel(inst110_out), .wr(inst107_out));  // open: o
  SRAM1 inst124 (.i(inst123_out), .sel(inst123_out), .wr(inst120_out));  // open: o
  SRAM1 inst137 (.i(inst136_out), .sel(inst136_out), .wr(inst133_out));  // open: o
  SRAM1 inst7 (.i(inst6_out), .sel(undriven_42), .wr(inst5_out));  // open: o
  SRAM1 inst163 (.sel(undriven_5), .wr(inst207_out), .o(inst163_o));  // open: i
  SRAM1 inst175 (.sel(undriven_5), .wr(inst170_out), .o(inst175_o));  // open: i
  SRAM1 inst189 (.sel(undriven_37), .wr(inst184_out), .o(inst189_o));  // open: i
  SRAM1 inst202 (.sel(undriven_40), .wr(inst197_out), .o(inst202_o));  // open: i
  SRAM1 inst86 (.sel(undriven_19), .wr(inst81_out), .o(inst86_o));  // open: i
  SRAM1 inst99 (.sel(undriven_22), .wr(inst94_out), .o(inst99_o));  // open: i
  SRAM1 inst112 (.sel(undriven_25), .wr(inst107_out), .o(inst112_o));  // open: i
  SRAM1 inst125 (.sel(undriven_28), .wr(inst120_out), .o(inst125_o));  // open: i
  SRAM1 inst138 (.sel(undriven_31), .wr(inst133_out), .o(inst138_o));  // open: i
  SRAM1 inst151 (.sel(undriven_34), .wr(inst146_out), .o(inst151_o));  // open: i
  SRAM1 inst8 (.sel(undriven_42), .wr(inst5_out), .o(inst8_o));  // open: i
  SRAM1 inst20 (.sel(undriven_3), .wr(inst15_out), .o(inst20_o));  // open: i
  SRAM1 inst34 (.sel(undriven_7), .wr(inst29_out), .o(inst34_o));  // open: i
  SRAM1 inst47 (.sel(undriven_10), .wr(inst42_out), .o(inst47_o));  // open: i
  SRAM1 inst60 (.sel(undriven_13), .wr(inst55_out), .o(inst60_o));  // open: i
  SRAM1 inst73 (.sel(undriven_16), .wr(inst68_out), .o(inst73_o));  // open: i
  TRI inst152 (.IN(inst151_o), .OE(undriven_5), .OUT(inst152_out));
  TRI inst164 (.IN(inst163_o), .OE(undriven_5), .OUT(inst164_out));
  TRI inst176 (.IN(inst175_o), .OE(undriven_5), .OUT(inst176_out));
  TRI inst190 (.IN(inst189_o), .OE(undriven_5), .OUT(inst190_out));
  TRI inst203 (.IN(inst202_o), .OE(SEL34), .OUT(inst203_out));
  TRI inst9 (.IN(inst8_o), .OE(undriven_42), .OUT(inst9_out));
  TRI inst21 (.IN(inst20_o), .OE(undriven_41), .OUT(inst21_out));
  TRI inst35 (.IN(inst34_o), .OE(undriven_5), .OUT(inst35_out));
  TRI inst48 (.IN(inst47_o), .OE(undriven_5), .OUT(inst48_out));
  TRI inst61 (.IN(inst60_o), .OE(undriven_5), .OUT(inst61_out));
  TRI inst74 (.IN(inst73_o), .OE(undriven_5), .OUT(inst74_out));
  TRI inst87 (.IN(inst86_o), .OE(undriven_5), .OUT(inst87_out));
  TRI inst100 (.IN(inst99_o), .OE(undriven_5), .OUT(inst100_out));
  TRI inst113 (.IN(inst112_o), .OE(undriven_5), .OUT(inst113_out));
  TRI inst126 (.IN(inst125_o), .OE(undriven_5), .OUT(inst126_out));
  TRI inst139 (.IN(inst138_o), .OE(undriven_5), .OUT(inst139_out));
  SRAM1 inst153 (.i(inst152_out), .sel(undriven_5), .wr(inst146_out));  // open: o
  SRAM1 inst165 (.i(inst164_out), .sel(undriven_5), .wr(inst207_out));  // open: o
  SRAM1 inst177 (.i(inst176_out), .sel(undriven_5), .wr(inst170_out));  // open: o
  SRAM1 inst191 (.i(inst190_out), .sel(undriven_5), .wr(inst184_out));  // open: o
  SRAM1 inst204 (.i(inst203_out), .sel(SEL34), .wr(inst197_out));  // open: o
  SRAM1 inst10 (.i(inst9_out), .sel(undriven_42), .wr(inst5_out));  // open: o
  SRAM1 inst22 (.i(inst21_out), .sel(undriven_41), .wr(inst15_out));  // open: o
  SRAM1 inst36 (.i(inst35_out), .sel(undriven_5), .wr(inst29_out));  // open: o
  SRAM1 inst49 (.i(inst48_out), .sel(undriven_5), .wr(inst42_out));  // open: o
  SRAM1 inst62 (.i(inst61_out), .sel(undriven_5), .wr(inst55_out));  // open: o
  SRAM1 inst75 (.i(inst74_out), .sel(undriven_5), .wr(inst68_out));  // open: o
  SRAM1 inst88 (.i(inst87_out), .sel(undriven_5), .wr(inst81_out));  // open: o
  SRAM1 inst101 (.i(inst100_out), .sel(undriven_5), .wr(inst94_out));  // open: o
  SRAM1 inst114 (.i(inst113_out), .sel(undriven_5), .wr(inst107_out));  // open: o
  SRAM1 inst127 (.i(inst126_out), .sel(undriven_5), .wr(inst120_out));  // open: o
  SRAM1 inst140 (.i(inst139_out), .sel(undriven_5), .wr(inst133_out));  // open: o
  SRAM1 inst166 (.sel(undriven_5), .wr(inst207_out), .o(inst166_o));  // open: i
  SRAM1 inst178 (.sel(undriven_5), .wr(inst170_out), .o(inst178_o));  // open: i
  SRAM1 inst192 (.sel(undriven_5), .wr(inst184_out), .o(inst192_o));  // open: i
  SRAM1 inst205 (.sel(SEL34), .wr(inst197_out), .o(inst205_o));  // open: i
  SRAM1 inst63 (.sel(undriven_5), .wr(inst55_out), .o(inst63_o));  // open: i
  SRAM1 inst76 (.sel(undriven_5), .wr(inst68_out), .o(inst76_o));  // open: i
  SRAM1 inst89 (.sel(undriven_5), .wr(inst81_out), .o(inst89_o));  // open: i
  SRAM1 inst102 (.sel(undriven_5), .wr(inst94_out), .o(inst102_o));  // open: i
  SRAM1 inst115 (.sel(undriven_5), .wr(inst107_out), .o(inst115_o));  // open: i
  SRAM1 inst128 (.sel(undriven_5), .wr(inst120_out), .o(inst128_o));  // open: i
  SRAM1 inst141 (.sel(undriven_5), .wr(inst133_out), .o(inst141_o));  // open: i
  SRAM1 inst154 (.sel(undriven_5), .wr(inst146_out), .o(inst154_o));  // open: i
  SRAM1 inst11 (.sel(undriven_42), .wr(inst5_out), .o(inst11_o));  // open: i
  SRAM1 inst24 (.sel(undriven_41), .wr(inst15_out), .o(inst24_o));  // open: i
  SRAM1 inst37 (.sel(undriven_5), .wr(inst29_out), .o(inst37_o));  // open: i
  SRAM1 inst50 (.sel(undriven_5), .wr(inst42_out), .o(inst50_o));  // open: i
  TRI inst193 (.IN(inst192_o), .OE(undriven_5), .OUT(inst193_out));
  TRI inst206 (.IN(inst205_o), .OE(SEL34), .OUT(inst206_out));
  TRI inst155 (.IN(inst154_o), .OE(undriven_5), .OUT(inst206_out));
  TRI inst167 (.IN(inst166_o), .OE(undriven_5), .OUT(inst206_out));
  TRI inst179 (.IN(inst178_o), .OE(undriven_5), .OUT(inst206_out));
  TRI inst12 (.IN(inst11_o), .OE(undriven_42), .OUT(inst206_out));
  TRI inst25 (.IN(inst24_o), .OE(undriven_41), .OUT(inst206_out));
  TRI inst38 (.IN(inst37_o), .OE(undriven_5), .OUT(inst206_out));
  TRI inst51 (.IN(inst50_o), .OE(undriven_5), .OUT(inst206_out));
  TRI inst64 (.IN(inst63_o), .OE(undriven_5), .OUT(inst206_out));
  TRI inst77 (.IN(inst76_o), .OE(undriven_5), .OUT(inst206_out));
  TRI inst90 (.IN(inst89_o), .OE(undriven_5), .OUT(inst206_out));
  TRI inst103 (.IN(inst102_o), .OE(undriven_5), .OUT(inst206_out));
  TRI inst116 (.IN(inst115_o), .OE(undriven_5), .OUT(inst206_out));
  TRI inst129 (.IN(inst128_o), .OE(undriven_5), .OUT(inst206_out));
  TRI inst142 (.IN(inst141_o), .OE(undriven_5), .OUT(inst206_out));
  bcd inst209 (.bin({4{inst206_out}}), .hundreds(inst209_hundreds), .tens(inst209_tens), .ones(inst209_ones));
  decode4to16 inst208 (.four(inst209_hundreds), .led(hun));
  decode4to16 inst210 (.four(inst209_tens), .led(ten));
  decode4to16 inst211 (.four(inst209_ones), .led(one));
endmodule
